# Altium project TK521_Optisk-plugg.PrjPcb
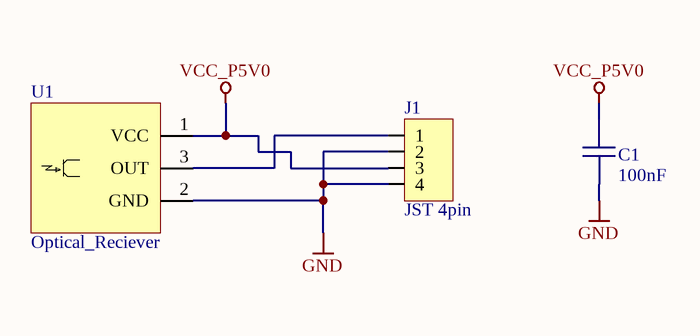
[diagram p0: TK521_Optisk-plugg.SchDoc]
1 sheet, 3 parts. Net scope: global (net labels, ports and power ports of the same name join across sheets).
Board file: TK521_Optisk-plugg.PcbDoc

## Sheet TK521_Optisk-plugg.SchDoc: TK520 GDT-Trafo
size A3; Author: Øystein Smith; Organization: Omega Verksted; DocumentNumber: 13; Revision: 1; SheetNumber: 13; SheetTotal: 20

### Parts
C1  100nF  [CAPC0603(1608)55_N]
J1  JST 4pin  [JST_4P]
U1  Optical_Reciever  [TOSLINK_TH]

### Nets
GND: C1.1 J1.2 J1.4 U1.2(GND)
VCC_P5V0: C1.2 J1.3 U1.1(VCC)
NetJ1_1: J1.1 U1.3(OUT)

### Notes on the sheet
- Size:
- Date:
- Title:
- A3
- Revision:
- Sheet
- of
- Author:
- File:

### Library data of the parts
C1 = 3028: X7R 50V 5%; id: 3028; pakke_opprettet_av: 815; pakke_opprettet: 18.02.2015 14.18.13; symbol_opprettet: 14.11.2014 20.19.34; leverandor_varenr: 1759122; pris: 1; nokkelord: Kondensator, Capacitor, CAP; produsent: Multikomp; leverandor: Farnell; pakketype: 0603; symbol_opprettet_av: 815; navn: 100nF
J1 = 2225: pris pr. stk.; id: 2225; rad: 3; rom: OV; lager_type: Fremlager; dybde: 0; hylle: 10; antall: 100; kolonne: 2; pakke_opprettet_av: 815; pakke_opprettet: 28.06.2014 18.25.23; symbol_opprettet: 28.06.2014 15.33.28; nokkelord: Connector, Kontakt; pakketype: TH; symbol_opprettet_av: 815; navn: JST 4pin; pris: 2
U1 = 2380: TOSLINK Reciever; id: 2380; pakke_opprettet_av: 815; pakke_opprettet: 28.06.2014 18.02.12; symbol_opprettet: 28.06.2014 15.42.01; leverandor_varenr: 1243863; navn: GP1FAV50RK; pris: 12; nokkelord: Optic, fibre, optisk, fiber; produsent: Sharp; leverandor: Farnell; pakketype: TH; symbol_opprettet_av: 815